# Altium schematic sheet Rear ECU.SchDoc
size A4
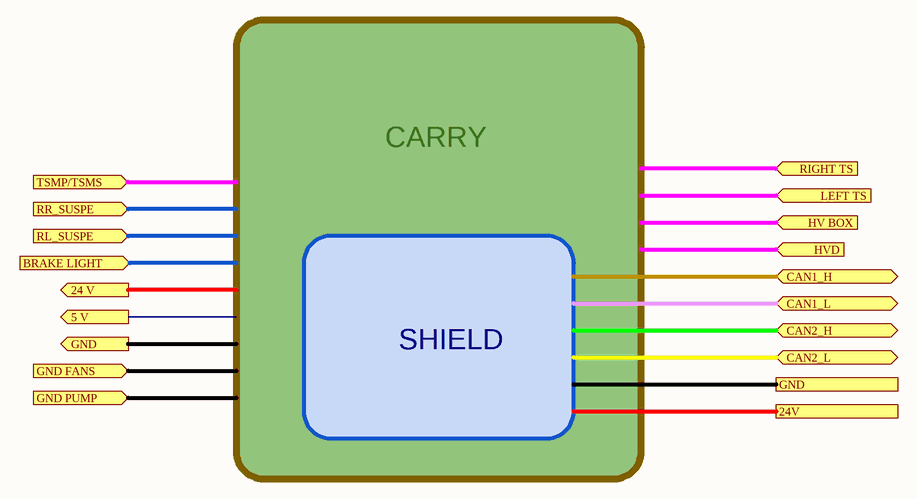
[diagram p0: Rear ECU.SchDoc]

## Ports
5 V (out), 24 V (out), 24V, BRAKE LIGHT (in), CAN1_H (bidir), CAN1_L (bidir), CAN2_H (bidir), CAN2_L (bidir), GND, GND (out), GND FANS (in), GND PUMP (in), HV BOX (in), HVD (in), LEFT TS (in), RIGHT TS (in), RL_SUSPE (in), RR_SUSPE (in), TSMP/TSMS (in)

## Notes on the sheet
- CARRY
- SHIELD